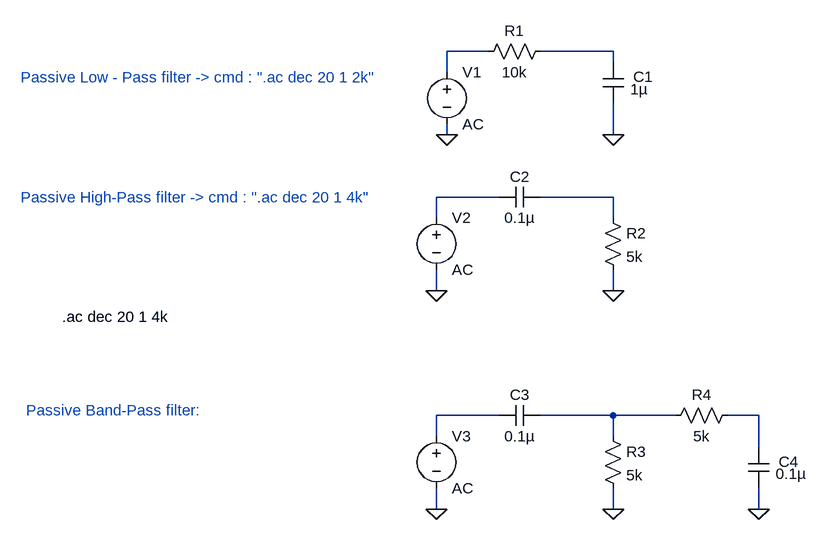
[diagram p0: schematic HPF_LPF_BPF.asc]
HPF_LPF_BPF.asc, the LTspice schematic file:
Version 4
SHEET 1 880 916
WIRE 240 192 176 192
WIRE 432 192 320 192
WIRE 432 208 432 192
WIRE 176 224 176 192
WIRE 176 320 176 304
WIRE 432 320 432 272
WIRE 256 416 160 416
WIRE 432 416 320 416
WIRE 160 448 160 416
WIRE 432 448 432 416
WIRE 160 560 160 528
WIRE 432 560 432 528
WIRE 256 752 160 752
WIRE 432 752 320 752
WIRE 528 752 432 752
WIRE 656 752 608 752
WIRE 160 784 160 752
WIRE 432 784 432 752
WIRE 656 800 656 752
WIRE 160 896 160 864
WIRE 432 896 432 864
WIRE 656 896 656 864
FLAG 176 320 0
FLAG 432 320 0
FLAG 160 560 0
FLAG 432 560 0
FLAG 160 896 0
FLAG 432 896 0
FLAG 656 896 0
SYMBOL res 336 176 R90
WINDOW 0 0 56 VBottom 2
WINDOW 3 32 56 VTop 2
SYMATTR InstName R1
SYMATTR Value 10k
SYMBOL cap 416 208 R0
WINDOW 0 47 23 Left 2
WINDOW 3 42 42 Left 2
SYMATTR InstName C1
SYMATTR Value 1µ
SYMBOL voltage 176 208 R0
WINDOW 123 0 0 Left 0
WINDOW 39 0 0 Left 0
SYMATTR InstName V1
SYMATTR Value AC
SYMBOL voltage 160 432 R0
WINDOW 123 0 0 Left 0
WINDOW 39 0 0 Left 0
SYMATTR InstName V2
SYMATTR Value AC
SYMBOL res 416 432 R0
SYMATTR InstName R2
SYMATTR Value 5k
SYMBOL cap 320 400 R90
WINDOW 0 0 32 VBottom 2
WINDOW 3 32 32 VTop 2
SYMATTR InstName C2
SYMATTR Value 0.1µ
SYMBOL voltage 160 768 R0
WINDOW 123 0 0 Left 0
WINDOW 39 0 0 Left 0
SYMATTR InstName V3
SYMATTR Value AC
SYMBOL res 416 768 R0
SYMATTR InstName R3
SYMATTR Value 5k
SYMBOL cap 320 736 R90
WINDOW 0 0 32 VBottom 2
WINDOW 3 32 32 VTop 2
SYMATTR InstName C3
SYMATTR Value 0.1µ
SYMBOL res 624 736 R90
WINDOW 0 0 56 VBottom 2
WINDOW 3 32 56 VTop 2
SYMATTR InstName R4
SYMATTR Value 5k
SYMBOL cap 640 800 R0
WINDOW 0 47 23 Left 2
WINDOW 3 42 42 Left 2
SYMATTR InstName C4
SYMATTR Value 0.1µ
TEXT -416 600 Left 2 !.ac dec 20 1 4k
TEXT -480 232 Left 2 ;Passive Low - Pass filter -> cmd : ".ac dec 20 1 2k"
TEXT -480 416 Left 2 ;Passive High-Pass filter -> cmd : ".ac dec 20 1 4k"
TEXT -472 744 Left 2 ;Passive Band-Pass filter:

The netlist it stands for:
* HPF_LPF_BPF.asc
R1 N002 N001 10k
C1 N002 0 1µ
V1 N001 0 AC
V2 N003 0 AC
R2 N004 0 5k
C2 N004 N003 0.1µ
V3 N005 0 AC
R3 N006 0 5k
C3 N006 N005 0.1µ
R4 N007 N006 5k
C4 N007 0 0.1µ
.ac dec 20 1 4k
* Passive Low - Pass filter -> cmd : ".ac dec 20 1 2k"
* Passive High-Pass filter -> cmd : ".ac dec 20 1 4k"
* Passive Band-Pass filter:
.backanno
.end